# Altium schematic sheet Main.SchDoc: CC2511 AS2 G1
size A4; CompanyName: James Cook University; DrawnBy: CC2511 AS2 Group 1; Organization: James Cook University; Revision: 1.0; SheetNumber: 1; SheetTotal: 4; ProjectName: *ProjectName
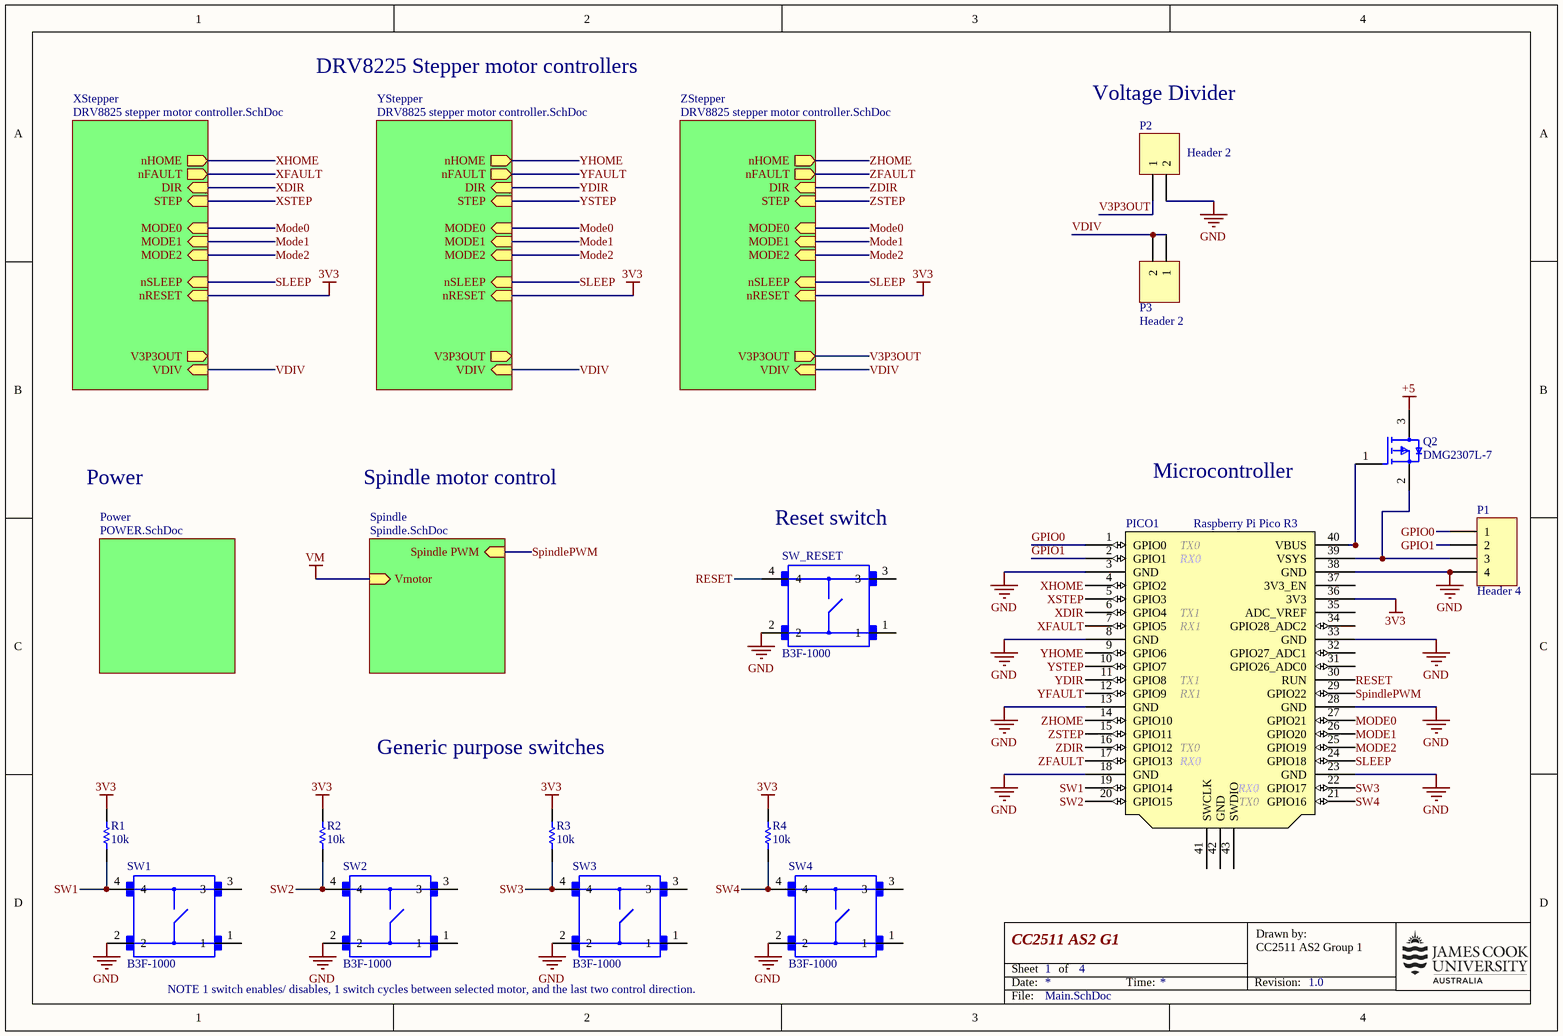
[diagram p0: Main.SchDoc]

## Parts
P1  Header 4  [HDR1X4]
P2  Header 2  [HDR1X2]
P3  Header 2  [HDR1X2]
PICO1  Raspberry Pi Pico R3  [RASPI_PICO_83]
Q2  DMG2307L-7  [FP-SOT23-MFG]
R1  10k  [RESC2013X60X35ML10T20]
R2  10k  [RESC2013X60X35ML10T20]
R3  10k  [RESC2013X60X35ML10T20]
R4  10k  [RESC2013X60X35ML10T20]
SW1  B3F-1000  [SW_B3F-1000]
SW2  B3F-1000  [SW_B3F-1000]
SW3  B3F-1000  [SW_B3F-1000]
SW4  B3F-1000  [SW_B3F-1000]
SW_RESET  B3F-1000  [SW_B3F-1000]

## Sub-sheets
Power = POWER.SchDoc: no entries
Spindle = Spindle.SchDoc: Spindle PWM (in), Vmotor (in)
XStepper = DRV8825 stepper motor controller.SchDoc: nHOME (out), nFAULT (out), DIR (in), STEP (in), MODE0 (in), MODE1 (in), MODE2 (in), nSLEEP (in), nRESET (in), V3P3OUT (out), VDIV (in)
YStepper = DRV8825 stepper motor controller.SchDoc: nHOME (out), nFAULT (out), DIR (in), STEP (in), MODE0 (in), MODE1 (in), MODE2 (in), nSLEEP (in), nRESET (in), V3P3OUT (out), VDIV (in)
ZStepper = DRV8825 stepper motor controller.SchDoc: nHOME (out), nFAULT (out), DIR (in), STEP (in), MODE0 (in), MODE1 (in), MODE2 (in), nSLEEP (in), nRESET (in), V3P3OUT (out), VDIV (in)

## Nets
3V3: PICO1.36(3V3) R1.1 R2.1 R3.1 R4.1 ; sheet XStepper/nRESET, sheet YStepper/nRESET, sheet ZStepper/nRESET
+5: Q2.3(D)
GND: P1.4 P2.2 PICO1.3(GND) PICO1.8(GND) PICO1.13(GND) PICO1.18(GND) PICO1.23(GND) PICO1.28(GND) PICO1.33(GND) PICO1.38(GND) SW1.2 SW2.2 SW3.2 SW4.2 SW_RESET.2
VM: sheet Spindle/Vmotor
GPIO0: P1.1 PICO1.1(GPIO0)
GPIO1: P1.2 PICO1.2(GPIO1)
Mode0: PICO1.27(GPIO21) ; sheet XStepper/MODE0, sheet YStepper/MODE0, sheet ZStepper/MODE0
Mode1: PICO1.26(GPIO20) ; sheet XStepper/MODE1, sheet YStepper/MODE1, sheet ZStepper/MODE1
Mode2: PICO1.25(GPIO19) ; sheet XStepper/MODE2, sheet YStepper/MODE2, sheet ZStepper/MODE2
RESET: PICO1.30(RUN) SW_RESET.4
SLEEP: PICO1.24(GPIO18) ; sheet XStepper/nSLEEP, sheet YStepper/nSLEEP, sheet ZStepper/nSLEEP
SpindlePWM: PICO1.29(GPIO22) ; sheet Spindle/Spindle PWM
SW1: PICO1.19(GPIO14) R1.2 SW1.4
SW2: PICO1.20(GPIO15) R2.2 SW2.4
SW3: PICO1.22(GPIO17) R3.2 SW3.4
SW4: PICO1.21(GPIO16) R4.2 SW4.4
V3P3OUT: P2.1 ; sheet ZStepper/V3P3OUT
VDIV: P3.1 P3.2 ; sheet XStepper/VDIV, sheet YStepper/VDIV, sheet ZStepper/VDIV
XDIR: PICO1.6(GPIO4) ; sheet XStepper/DIR
XFAULT: PICO1.7(GPIO5) ; sheet XStepper/nFAULT
XHOME: PICO1.4(GPIO2) ; sheet XStepper/nHOME
XSTEP: PICO1.5(GPIO3) ; sheet XStepper/STEP
YDIR: PICO1.11(GPIO8) ; sheet YStepper/DIR
YFAULT: PICO1.12(GPIO9) ; sheet YStepper/nFAULT
YHOME: PICO1.9(GPIO6) ; sheet YStepper/nHOME
YSTEP: PICO1.10(GPIO7) ; sheet YStepper/STEP
ZDIR: PICO1.16(GPIO12) ; sheet ZStepper/DIR
ZFAULT: PICO1.17(GPIO13) ; sheet ZStepper/nFAULT
ZHOME: PICO1.14(GPIO10) ; sheet ZStepper/nHOME
ZSTEP: PICO1.15(GPIO11) ; sheet ZStepper/STEP
NetP1_3: P1.3 PICO1.39(VSYS) Q2.2(S)
NetPICO1_40: PICO1.40(VBUS) Q2.1(G)

Not connected (* = marked no-connect by the designer): PICO1 31(GPIO26_ADC0) 32(GPIO27_ADC1) 34(GPIO28_ADC2) 35(ADC_VREF) 37(3V3_EN) 41(SWCLK) 42(GND) 43(SWDIO); SW1 1 3; SW2 1 3; SW3 1 3; SW4 1 3; SW_RESET 1 3

## Notes on the sheet
- DRV8225 Stepper motor controllers
- Voltage Divider
- Power
- Spindle motor control
- Microcontroller
- (near SW_RESET) Reset switch
- Generic purpose switches
- NOTE 1 switch enables/ disables, 1 switch cycles between selected motor, and the last two control direction.
- Date:
- Sheet
- of
- Time:
- Revision:
- Drawn by:
- File:
- (in symbol Rapberry Pi Pico-R3) TX0; RX0; TX1; RX1

## Library data of the parts
P1 = Header 4: Header, 4-Pin; LatestRevisionDate: 17-Jul-2002; LatestRevisionNote: Re-released for DXP Platform.; Publisher: Altium Limited
P2 P3 = Header 2: Header, 2-Pin; LatestRevisionDate: 17-Jul-2002; LatestRevisionNote: Re-released for DXP Platform.; Publisher: Altium Limited
PICO1 = Rapberry Pi Pico-R3
Q2 = CMP-12801-000080-1: MOSFET P-CH 30V 2.5A SOT-23; Gate to Source Voltage (Vgs): 20V; Rise Time: 7.3ns; Power Dissipation: 1.36W; Rds On Max: 90mR; Fall Time: 13.4ns; Number of Channels: 1; Turn-On Delay Time: 4.8ns; Element Configuration: Single; Turn-Off Delay Time: 22.4ns; Input Capacitance: 371.3pF; Continuous Drain Current (ID): 3.8A; Max Power Dissipation: 760mW; Min Operating Temperature: -55°C; Width: 1.4mm; Packaging: Tape and Reel; Max Operating Temperature: 150°C; Case/Package: SOT-23; Weight: 0.000282oz; Length: 3mm; Lead Free: Lead Free; Package Quantity: 3000; Radiation Hardening: No; Drain to Source Resistance: 90mR; Height: 1mm; REACH SVHC: No SVHC; Number of Pins: 3; Number of Elements: 1; Drain to Source Voltage (Vdss): 30V; Mount: Surface Mount
R1-R4 = CMP-2000-05025-1: Chip Resistor, 10 KOhm, +/- 5%, 0.125 W, -55 to 155 degC, 0805 (2012 Metric), RoHS, Tape and Reel; Manufacturer: Yageo; Resistor Element Type: ThickFilm; Voltage Rating: 150V; Product Range: RCSeries; SVHC: ToBeAdvised; Resistor Case Style: 0805[2012Metric]; Temperature Coefficient: ±100ppm/degC; Power Rating: 250mW; Resistance: 10kohm; Automotive Qualification Standard: -; Datasheet Version: REV. 2, 09/2004; Packaging: CutTape; Resistance Tolerance: ±5%; MSL: MSL1-Unlimited; Manufacturer URL: http://www.yageo.com/; Datasheet URL: http://www.yageo.ru/pdf/RC0805.pdf; Package Description: 2-Pin Surface Mounted Device, Body 2 x 1.25 mm; Package Reference: 805
SW1-SW4 SW_RESET = B3F-1000: Switch Tactile N.O. SPST Flat Round Button PC Pins 0.05A 24VDC 1000000Cycles 0.98N Thru-Hole Bag; MF: Omron; Actuator Color: Grey; Illumination Type: Non-Illuminated,Illuminated; Max Voltage Rating (DC): 24V; Contact Current Rating: 50mA; Switch Travel: 0.25mm; Switch Function: Off-Mom; Contact Resistance: 100mR; Number of Poles: 1; Actuator Type: Standard; Actuator Length: 0.9mm; Price: None; Package: None; MP: B3F-1000; Value: *; Availability: Unavailable; SnapEDA_Link: https://www.snapeda.com/parts/B3F-1000/Omron%20Electronics%20Inc-EMC%20Div/view-part/48569/?ref=snap; Supplier 1: Digi-Key; Manufacturer: Omron; Manufacturer Part Number: B3F-1000; RoHS: Yes; Category: Tactile Switches; Stock 1: 24669; Pricing 1: 1=0.29000, 10=0.28400, 25=0.26960, 100=0.24430, 250=0.22268, 500=0.20700, 1000=0.17658, 2500=0.17168 (USD); Mount: Through Hole; Number of Pins: 4; Contact Plating: Gold; Mechanical Life: 1000000Cycles; Weight: 0.008818oz; Contact Material: Gold,Silver; Min Operating Temperature: -25°C; Max Operating Temperature: 70°C; Package Quantity: 1500; Packaging: Bag; Series: B3F; Throw Configuration: SPST; Operating Force: 0.98N; Termination: PC Pins; Voltage Rating (DC): 24V; Current Rating: 50mA; Max Current Rating: 50mA; Electrical Life: 1000000Cycles; Orientation: Straight; Insulation Resistance: 100MR; Length: 6mm; Width: 6mm; Height: 3.4mm; Depth: 6mm; Lead Free: Lead Free; REACH SVHC: Unknown; RoHS Compliant: Yes; ComponentLink1URL: https://datasheet.ciiva.com/19453/162886-19453387.pdf?src-supplier=Jameco; ComponentLink1Description: https://datasheet.ciiva.com/19453/162886-19453387.pdf?src-supplier=Jameco; ComponentLink2URL: https://datasheet.ciiva.com/26883/getdatasheetpartid-388862-26883373.pdf?src-supplier=Verical; ComponentLink2Description: https://datasheet.ciiva.com/26883/getdatasheetpartid-388862-26883373.pdf?src-supplier=Verical; ComponentLink3URL: https://datasheet.ciiva.com/1701/en-b3f-1701027.pdf?src-supplier=Newark; ComponentLink3Description: https://datasheet.ciiva.com/1701/en-b3f-1701027.pdf?src-supplier=Newark; ComponentLink4URL: https://datasheet.ciiva.com/1532/en-b3f-1532548.pdf?src-supplier=Element14; ComponentLink4Description: https://datasheet.ciiva.com/1532/en-b3f-1532548.pdf?src-supplier=Element14; ComponentLink5URL: https://datasheet.ciiva.com/2899/b3f-0811-2899719.pdf?src-supplier=Digi-Key; ComponentLink5Description: https://datasheet.ciiva.com/2899/b3f-0811-2899719.pdf?src-supplier=Digi-Key; ComponentLink6URL: https://datasheet.ciiva.com/14142/b3f-eng-datasheet-14142455.pdf?src-supplier=Distrelec; ComponentLink6Description: https://datasheet.ciiva.com/14142/b3f-eng-datasheet-14142455.pdf?src-supplier=Distrelec; ComponentLink7URL: https://datasheet.ciiva.com/16154/en-b3f-16154887.pdf?src-supplier=Onlinecomponents.com; ComponentLink7Description: https://datasheet.ciiva.com/16154/en-b3f-16154887.pdf?src-supplier=Onlinecomponents.com; ComponentLink8URL: https://datasheet.ciiva.com/5283/b3f-0811-26083-5283547.pdf?src-supplier=Mouser; ComponentLink8Description: https://datasheet.ciiva.com/5283/b3f-0811-26083-5283547.pdf?src-supplier=Mouser; ComponentLink9URL: https://datasheet.ciiva.com/14539/70175266-14539084.pdf?src-supplier=Allied+Electronics; ComponentLink9Description: https://datasheet.ciiva.com/14539/70175266-14539084.pdf?src-supplier=Allied+Electronics; ComponentLink10URL: https://datasheet.ciiva.com/20148/78-0136-20148399.pdf?src-supplier=Rapid+Electronics; ComponentLink10Description: https://datasheet.ciiva.com/20148/78-0136-20148399.pdf?src-supplier=Rapid+Electronics; Supplier 2: Newark; Stock 2: 14988; Pricing 2: 10=0.35900, 25=0.34000, 50=0.32400, 100=0.30800, 250=0.28000 (USD)